# Altium project IP5389_5S_100W.PrjPcb
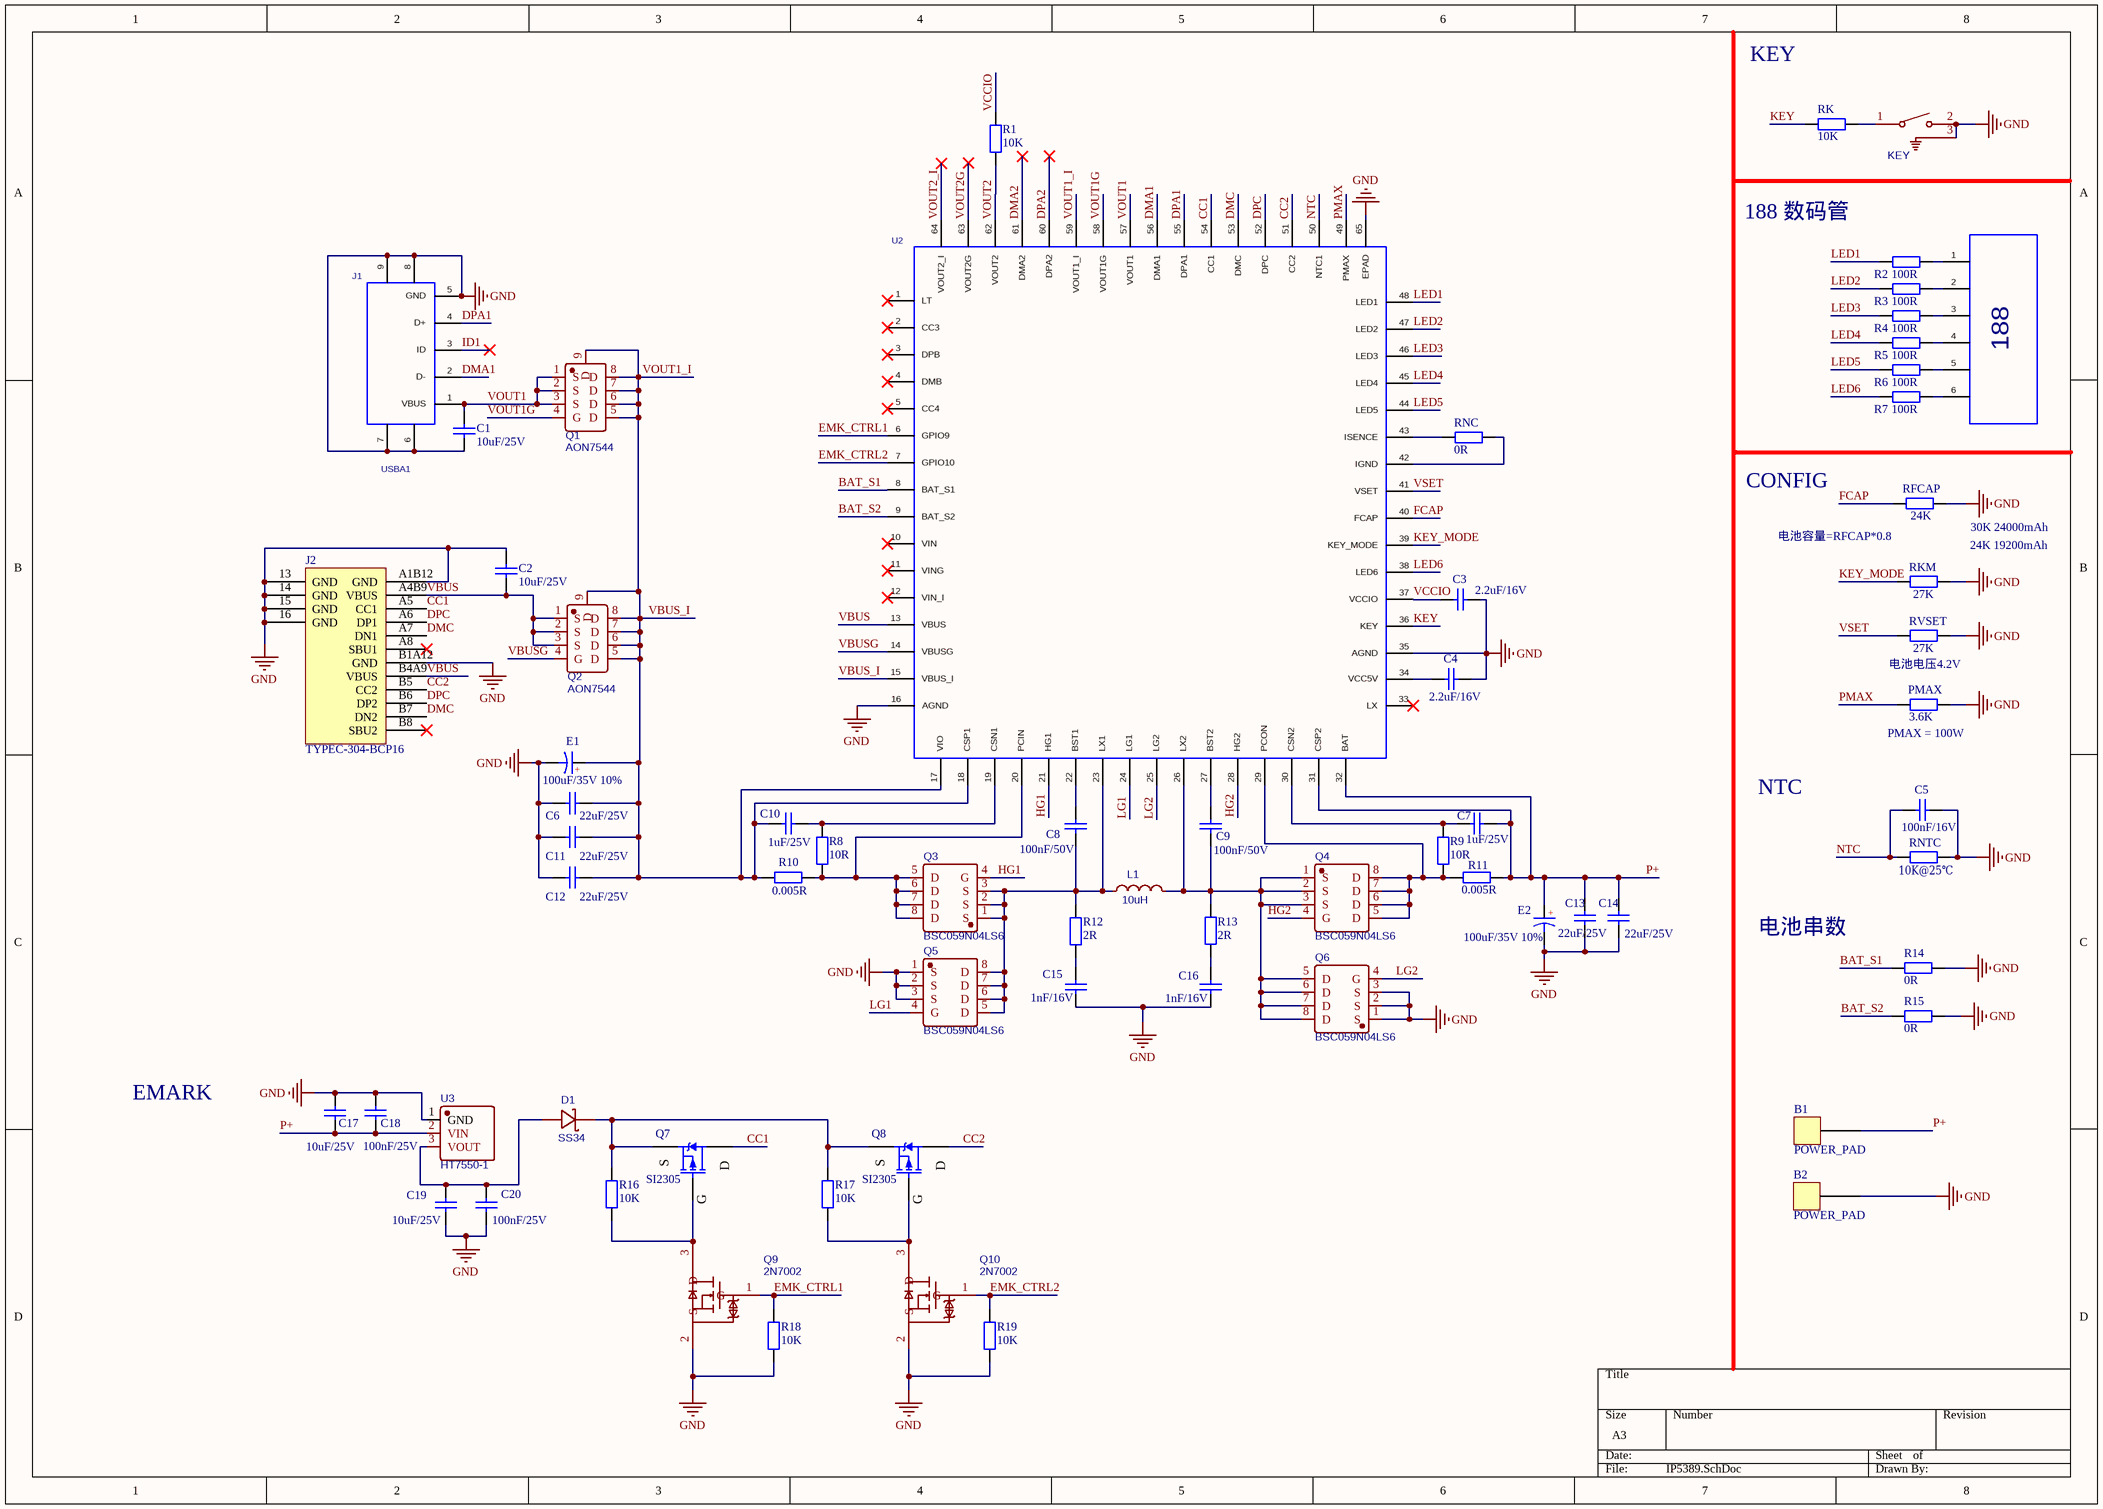
[diagram p0: IP5389.SchDoc]
1 sheet, 68 parts. Net scope: global (net labels, ports and power ports of the same name join across sheets).
Board file: IP5389_100W_PD.PcbDoc

## Sheet IP5389.SchDoc
size A3; SheetNumber: 1; SheetTotal: 1

### Parts
B1  POWER_PAD  [POWER_PAD]
B2  POWER_PAD  [POWER_PAD]
C1  10uF/25V  [C0603_M]
C2  10uF/25V  [C0603_M]
C3  2.2uF/16V  [C0603_M]
C4  2.2uF/16V  [C0603_M]
C5  100nF/16V  [C0603_M]
C6  22uF/25V  [C0603_M]
C7  1uF/25V  [C0603_M]
C8  100nF/50V  [C0603_M]
C9  100nF/50V  [C0603_M]
C10  1uF/25V  [C0603_M]
C11  22uF/25V  [C0603_M]
C12  22uF/25V  [C0603_M]
C13  22uF/25V  [C0603_M]
C14  22uF/25V  [C0603_M]
C15  1nF/16V  [C0603_M]
C16  1nF/16V  [C0603_M]
C17  10uF/25V  [C0603_M]
C18  100nF/25V  [C0603_M]
C19  10uF/25V  [C0603_M]
C20  100nF/25V  [C0603_M]
D1  SS34  [SS34-SMA]
E1  100uF/35V 10%  [CT 2.5*6.3*7 - C]
E2  100uF/35V 10%  [CT 2.5*6.3*7 - C]
J1  USBA1  [USB-A-5P]
J2  TYPEC-304-BCP16  [TYPE-C-16P]
KEY  TC-1109DE-C-G  [SWITCH]  (value not drawn)
L1  10uH  [10uH]
PMAX  3.6K  [R0603_M]
Q1  AON7544  [DFN-8_L3.0-W3.0-P0.65-BL]
Q2  AON7544  [DFN-8_L3.0-W3.0-P0.65-BL]
Q3  BSC059N04LS6  [PG-TDSON-8_L5.0-W6.0-P1.27-BL-EP]
Q4  BSC059N04LS6  [PG-TDSON-8_L5.0-W6.0-P1.27-BL-EP]
Q5  BSC059N04LS6  [PG-TDSON-8_L5.0-W6.0-P1.27-BL-EP]
Q6  BSC059N04LS6  [PG-TDSON-8_L5.0-W6.0-P1.27-BL-EP]
Q7  SI2305  [SOT23-3M]
Q8  SI2305  [SOT23-3M]
Q9  2N7002  [SOT-23-3_L2.9-W1.3-P1.90-LS2.4-BR]
Q10  2N7002  [SOT-23-3_L2.9-W1.3-P1.90-LS2.4-BR]
R1  10K  [R0603_M]
R2  100R  [R0603_M]
R3  100R  [R0603_M]
R4  100R  [R0603_M]
R5  100R  [R0603_M]
R6  100R  [R0603_M]
R7  100R  [R0603_M]
R8  10R  [R0603_M]
R9  10R  [R0603_M]
R10  0.005R  [R1206_L]
R11  0.005R  [R1206_L]
R12  2R  [R0603_M]
R13  2R  [R0603_M]
R14  0R  [R0603_M]
R15  0R  [R0603_M]
R16  10K  [R0603_M]
R17  10K  [R0603_M]
R18  10K  [R0603_M]
R19  10K  [R0603_M]
RFCAP  24K  [R0603_M]
RK  10K  [R0603_M]
RKM  27K  [R0603_M]
RNC  0R  [R0603_M]
RNTC  10K@25℃  [R0603_M]
RVSET  27K  [R0603_M]
U1  SMG_6PIN  [188SMG]  (value not drawn)
U2  IP5389  [IP5389]  (value not drawn)
U3  HT7550-1  [SOT89_N]

### Nets
GND: B2.1 C1.1 C2.2 C3.2 C4.2 C5.2 C6.1 C11.1 C12.1 C13.1 C14.1 C15.1 C16.1 C17.2 C18.2 C19.1 C20.1 E1.2 E2.2 J1.5(GND) J1.6 J1.7 J1.8 J1.9 J2.13(GND) J2.14(GND) J2.15(GND) J2.16(GND) J2.A1B12(GND) J2.B1A12(GND) KEY.2 KEY.3 PMAX.2 Q5.1(S) Q5.2(S) Q5.3(S) Q6.1(S) Q6.2(S) Q6.3(S) Q9.2(S) Q10.2(S) R14.2 R15.2 R18.1 R19.1 RFCAP.2 RKM.2 RNTC.2 RVSET.2 U2.16(AGND) U2.35(AGND) U2.65(EPAD) U3.1(GND)
BAT_S1: R14.1 U2.8(BAT_S1)
BAT_S2: R15.1 U2.9(BAT_S2)
CC1: J2.A5(CC1) Q7.3(D) U2.54(CC1)
CC2: J2.B5(CC2) Q8.3(D) U2.51(CC2)
DMA1: J1.2(D-) U2.56(DMA1)
DMA2: U2.61(DMA2)
DMC: J2.A7(DN1) J2.B7(DN2) U2.53(DMC)
DPA1: J1.4(D+) U2.55(DPA1)
DPA2: U2.60(DPA2)
DPC: J2.A6(DP1) J2.B6(DP2) U2.52(DPC)
EMK_CTRL1: Q9.1(G) R18.2 U2.6(GPIO9)
EMK_CTRL2: Q10.1(G) R19.2 U2.7(GPIO10)
FCAP: RFCAP.1 U2.40(FCAP)
HG1: Q3.4(G) U2.21(HG1)
HG2: Q4.4(G) U2.28(HG2)
ID1: J1.3(ID)
KEY: RK.1 U2.36(KEY)
KEY_MODE: RKM.1 U2.39(KEY_MODE)
LED1: R2.1 U2.48(LED1)
LED2: R3.1 U2.47(LED2)
LED3: R4.1 U2.46(LED3)
LED4: R5.1 U2.45(LED4)
LED5: R6.1 U2.44(LED5)
LED6: R7.1 U2.38(LED6)
LG1: Q5.4(G) U2.24(LG1)
LG2: Q6.4(G) U2.25(LG2)
NTC: C5.1 RNTC.1 U2.50(NTC1)
P+: B1.1 C7.2 C13.2 C14.2 C17.1 C18.1 E2.1 R11.2 U2.31(CSP2) U2.32(BAT) U3.2(VIN)
PMAX: PMAX.1 U2.49(PMAX)
VBUS: C2.1 J2.A4B9(VBUS) J2.B4A9(VBUS) Q2.1(S) Q2.2(S) Q2.3(S) U2.13(VBUS)
VBUS_I: C6.2 C10.1 C11.2 C12.2 E1.1 Q1.5(D) Q1.6(D) Q1.7(D) Q1.8(D) Q1.9(D) Q2.5(D) Q2.6(D) Q2.7(D) Q2.8(D) Q2.9(D) R10.1 U2.15(VBUS_I) U2.17(VIO) U2.18(CSP1) U2.59(VOUT1_I)  [also labelled VOUT1_I]
VBUSG: Q2.4(G) U2.14(VBUSG)
VCCIO: C3.1 R1.2 U2.37(VCCIO)
VOUT1: C1.2 J1.1(VBUS) Q1.1(S) Q1.2(S) Q1.3(S) U2.57(VOUT1)
VOUT1G: Q1.4(G) U2.58(VOUT1G)
VOUT2: R1.1 U2.62(VOUT2)
VOUT2_I: U2.64(VOUT2_I)
VOUT2G: U2.63(VOUT2G)
VSET: RVSET.1 U2.41(VSET)
NetC4_1: C4.1 U2.34(VCC5V)
NetC7_1: C7.1 R9.2 U2.30(CSN2)
NetC8_1: C8.1 L1.1 Q3.1(S) Q3.2(S) Q3.3(S) Q5.5(D) Q5.6(D) Q5.7(D) Q5.8(D) R12.2 U2.23(LX1)
NetC8_2: C8.2 U2.22(BST1)
NetC9_1: C9.1 L1.2 Q4.1(S) Q4.2(S) Q4.3(S) Q6.5(D) Q6.6(D) Q6.7(D) Q6.8(D) R13.2 U2.26(LX2)
NetC9_2: C9.2 U2.27(BST2)
NetC10_2: C10.2 R8.2 U2.19(CSN1)
NetC15_2: C15.2 R12.1
NetC16_2: C16.2 R13.1
NetC19_2: C19.2 C20.2 D1.2(A) U3.3(VOUT)
NetD1_1: D1.1(C) Q7.2(S) Q8.2(S) R16.2 R17.2
NetKEY_1: KEY.1 RK.2
NetQ3_5: Q3.5(D) Q3.6(D) Q3.7(D) Q3.8(D) R8.1 R10.2 U2.20(PCIN)
NetQ4_5: Q4.5(D) Q4.6(D) Q4.7(D) Q4.8(D) R9.1 R11.1 U2.29(PCON)
NetQ7_1: Q7.1(G) Q9.3(D) R16.1
NetQ8_1: Q8.1(G) Q10.3(D) R17.1
NetR2_2: R2.2 U1.1
NetR3_2: R3.2 U1.2
NetR4_2: R4.2 U1.3
NetR5_2: R5.2 U1.4
NetR6_2: R6.2 U1.5
NetR7_2: R7.2 U1.6
NetRNC_1: RNC.1 U2.43(ISENCE)
NetRNC_2: RNC.2 U2.42(IGND)

Not connected (* = marked no-connect by the designer): J2 A8(SBU1)* B8(SBU2)*; U2 1(LT)* 2(CC3)* 3(DPB)* 4(DMB)* 5(CC4)* 10(VIN)* 11(VING)* 12(VIN_I)* 33(LX)*

### Notes on the sheet
- KEY
- 188 数码管
- CONFIG
- 电池容量=RFCAP*0.8
- 24K 19200mAh
- 30K 24000mAh
- 电池电压4.2V
- (near PMAX) PMAX = 100W
- NTC
- 电池串数
- EMARK
- (in symbol CS) +
- (in symbol SMG_6PIN) 188

### Library data of the parts
C1-C20 = C: 贴片电容; BOM名称: 无极性贴片电容; 联系卖家，免费查找封装: 唯一出售店铺网址https://shop463601444.taobao.com
D1 = SS34_C408258: BOM_Manufacturer: SLKORMICRO Elec.; Contributor: LCSC; BOM_Supplier: LCSC; BOM_Supplier Part: C408258; BOM_Manufacturer Part: SS34; BOM_JLCPCB Part Class: Extended Part; spicePre: D; spiceSymbolName: SS34_C408258
E1 E2 = CS: 直插固态电容; 联系卖家，免费查找封装: 唯一出售店铺网址https://shop463601444.taobao.com; BOM名称: 直插固态电容
J1 = USBA_OPPO_9PIN: USB母座; PCB DECAL: USBA_OPPO_5PIN_6.3
J2 = TYPEC-304-BCP16: TYPEC-16P
KEY = KEY: BOM_Manufacturer: XKB Enterprise; Contributor: LCSC; BOM_Supplier: LCSC; BOM_Supplier Part: C400325; BOM_Manufacturer Part: TC-1109DE-C-G; BOM_JLCPCB Part Class: Extended Part; spicePre: S; spiceSymbolName: TC-1109DE-C-G
L1 = 10uH: BOM_Manufacturer: Sunltech Tech; BOM_Manufacturer Part: SLO1365S100MTT; nameAlias: Inductance; Contributor: LCSC; BOM_Supplier: LCSC; BOM_Supplier Part: C242228; BOM_JLCPCB Part Class: Extended Part; spicePre: L; spiceSymbolName: SLO1365S100MTT
PMAX R1-R19 RFCAP RK RKM RNC RVSET = R: 贴片电阻; 联系卖家，免费查找封装: 唯一出售店铺网址https://shop463601444.taobao.com; BOM名称: 贴片电阻
Q1 Q2 = AON7544: NMOS 30V 30A; BOM_Manufacturer: Alpha & Omega Semicon; Contributor: LCSC; BOM_Supplier: LCSC; BOM_Supplier Part: C315567; BOM_Manufacturer Part: AON7544; BOM_JLCPCB Part Class: Extended Part; spicePre: Q; spiceSymbolName: AON7544
Q3-Q6 = BSC059N04LS6: BOM_Manufacturer: Infineon Technologies; Contributor: LCSC; BOM_Supplier: LCSC; BOM_Supplier Part: C534356; BOM_Manufacturer Part: BSC059N04LS6; BOM_JLCPCB Part Class: Extended Part; spicePre: Q; spiceSymbolName: BSC059N04LS6
Q7 Q8 = SI2305: P沟道 20V/2.8A; BOM名称: P沟道场效应管; 联系卖家，免费查找封装: 唯一出售店铺网址https://shop463601444.taobao.com
Q9 Q10 = 2N7002_C916396: BOM_Manufacturer: JSMSEMI(杰盛微); Contributor: LCSC; BOM_Supplier: LCSC; BOM_Supplier Part: C916396; BOM_Manufacturer Part: 2N7002; BOM_JLCPCB Part Class: Extended Part; spicePre: Q; spiceSymbolName: 2N7002_C916396
RNTC = R: 10K@25℃ B=3380; BOM名称: 贴片电阻; 联系卖家，免费查找封装: 唯一出售店铺网址https://shop463601444.taobao.com
U1 = SMG_6PIN: 188数码管; PCB DECAL: YF2252SR-6
U2 = IP5389: IP5389 QFN64; PCB DECAL: QFN64
U3 = HT7550-1_C347189: 5V TinyPower LDO; BOM_Manufacturer: Youtai Semiconductor Co., Ltd.; Contributor: LCSC; BOM_Supplier: LCSC; BOM_Supplier Part: C347189; BOM_Manufacturer Part: HT7550-1; BOM_JLCPCB Part Class: Extended Part; spicePre: U; spiceSymbolName: HT7550-1_C347189